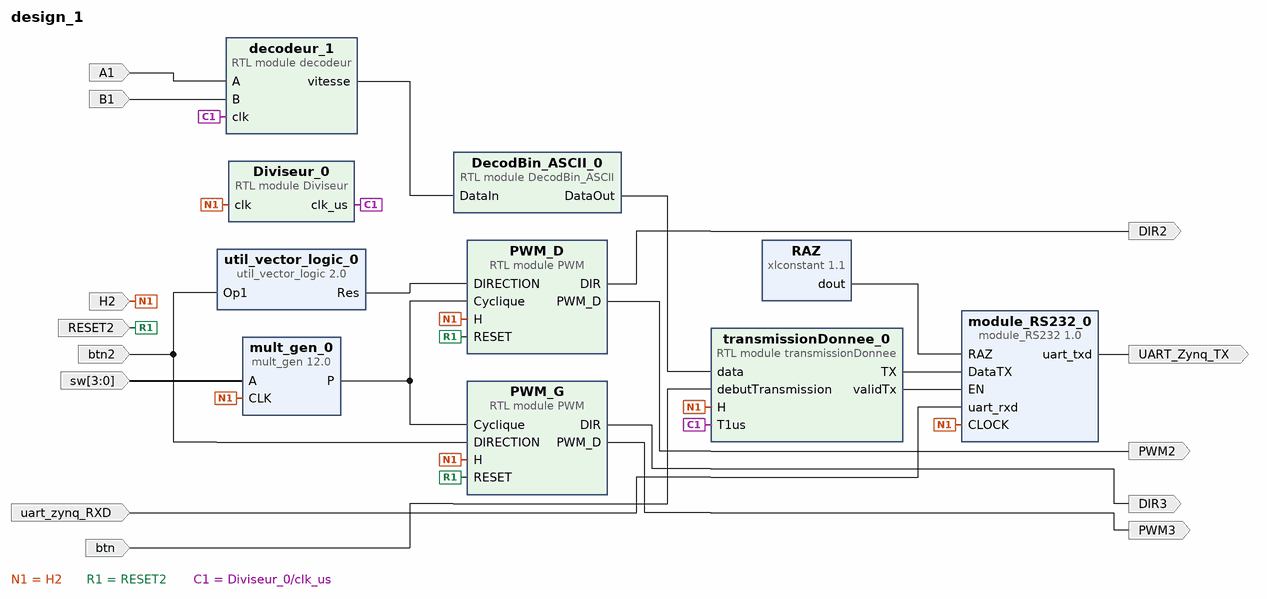
[diagram p0: block diagram of the top level]
# Vivado block design design_1, xc7z020clg400-1, Vivado 2020.2
create_bd_design design_1

create_bd_port -dir I H2
create_bd_port -dir I -type rst RESET2
create_bd_port -dir O DIR2
create_bd_port -dir O PWM2
create_bd_port -dir O DIR3
create_bd_port -dir O PWM3
create_bd_port -dir I A1
create_bd_port -dir I B1
create_bd_port -dir O UART_Zynq_TX
create_bd_port -dir I uart_zynq_RXD
create_bd_port -dir I -from 3 -to 0 -type data sw
create_bd_port -dir I btn
create_bd_port -dir I btn2

create_bd_cell -type ip -vlnv u-ga.fr:user:module_RS232:1.0 module_RS232_0
create_bd_cell -type module -reference transmissionDonnee transmissionDonnee_0
set_property -dict [list \
  CONFIG.NData 1 \
  CONFIG.dataSize 5 \
  CONFIG.period 8000 \
  CONFIG.periodOctet 1000 \
] [get_bd_cells transmissionDonnee_0]
create_bd_cell -type ip -vlnv xilinx.com:ip:xlconstant:1.1 RAZ
create_bd_cell -type module -reference DecodBin_ASCII DecodBin_ASCII_0
create_bd_cell -type ip -vlnv xilinx.com:ip:mult_gen:12.0 mult_gen_0
set_property -dict [list \
  CONFIG.ConstValue 416 \
  CONFIG.MultType Constant_Coefficient_Multiplier \
  CONFIG.OutputWidthHigh 15 \
  CONFIG.PortAType Unsigned \
  CONFIG.PortAWidth 4 \
  CONFIG.Use_Custom_Output_Width true \
] [get_bd_cells mult_gen_0]
create_bd_cell -type module -reference PWM PWM_D
create_bd_cell -type module -reference PWM PWM_G
create_bd_cell -type ip -vlnv xilinx.com:ip:util_vector_logic:2.0 util_vector_logic_0
set_property -dict {CONFIG.C_OPERATION not CONFIG.C_SIZE 1} [get_bd_cells util_vector_logic_0]
create_bd_cell -type module -reference Diviseur Diviseur_0
set_property -dict {CONFIG.nb_pulse_haut 0} [get_bd_cells Diviseur_0]
create_bd_cell -type module -reference decodeur decodeur_1

# ---- connections ----

connect_bd_net [get_bd_ports H2] \
  [get_bd_pins transmissionDonnee_0/H] [get_bd_pins module_RS232_0/CLOCK] [get_bd_pins mult_gen_0/CLK] [get_bd_pins PWM_D/H] \
  [get_bd_pins PWM_G/H] [get_bd_pins Diviseur_0/clk]
connect_bd_net -net RESET_0_1 [get_bd_ports RESET2] [get_bd_pins PWM_D/RESET] [get_bd_pins PWM_G/RESET]
connect_bd_net -net PWM_0_DIR [get_bd_pins PWM_D/DIR] [get_bd_ports DIR2]
connect_bd_net -net PWM [get_bd_pins PWM_D/PWM_D] [get_bd_ports PWM2]
connect_bd_net [get_bd_pins PWM_G/DIR] [get_bd_ports DIR3]
connect_bd_net [get_bd_pins PWM_G/PWM_D] [get_bd_ports PWM3]
connect_bd_net -net A1_1 [get_bd_ports A1] [get_bd_pins decodeur_1/A]
connect_bd_net -net B1_1 [get_bd_ports B1] [get_bd_pins decodeur_1/B]
connect_bd_net [get_bd_pins Diviseur_0/clk_us] [get_bd_pins transmissionDonnee_0/T1us] [get_bd_pins decodeur_1/clk]
connect_bd_net -net xlconstant_4_dout [get_bd_pins RAZ/dout] [get_bd_pins module_RS232_0/RAZ]
connect_bd_net [get_bd_pins transmissionDonnee_0/TX] [get_bd_pins module_RS232_0/DataTX]
connect_bd_net [get_bd_pins transmissionDonnee_0/validTx] [get_bd_pins module_RS232_0/EN]
connect_bd_net [get_bd_pins decodeur_1/vitesse] [get_bd_pins DecodBin_ASCII_0/DataIn]
connect_bd_net [get_bd_pins module_RS232_0/uart_txd] [get_bd_ports UART_Zynq_TX]
connect_bd_net [get_bd_ports uart_zynq_RXD] [get_bd_pins module_RS232_0/uart_rxd]
connect_bd_net -net A_0_1 [get_bd_ports sw] [get_bd_pins mult_gen_0/A]
connect_bd_net [get_bd_pins mult_gen_0/P] [get_bd_pins PWM_D/Cyclique] [get_bd_pins PWM_G/Cyclique]
connect_bd_net -net debutTransmission_0_1 [get_bd_ports btn] [get_bd_pins transmissionDonnee_0/debutTransmission]
connect_bd_net -net DIRECTION_0_1 [get_bd_ports btn2] [get_bd_pins PWM_G/DIRECTION] [get_bd_pins util_vector_logic_0/Op1]
connect_bd_net [get_bd_pins util_vector_logic_0/Res] [get_bd_pins PWM_D/DIRECTION]
connect_bd_net [get_bd_pins DecodBin_ASCII_0/DataOut] [get_bd_pins transmissionDonnee_0/data]

validate_bd_design
save_bd_design
